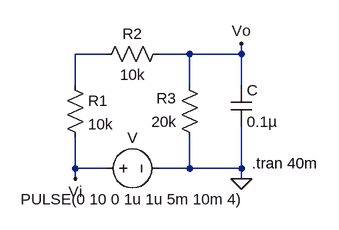
[diagram p0: schematic lab7-3.asc]
lab7-3.asc, the LTspice schematic file:
Version 4
SHEET 1 880 680
WIRE -48 64 -96 64
WIRE 80 64 32 64
WIRE 160 64 160 48
WIRE 160 64 80 64
WIRE -96 112 -96 64
WIRE 80 112 80 64
WIRE 160 112 160 64
WIRE -96 240 -96 192
WIRE -48 240 -96 240
WIRE 80 240 80 192
WIRE 80 240 32 240
WIRE 160 240 160 176
WIRE 160 240 80 240
WIRE -96 256 -96 240
WIRE 160 256 160 240
FLAG 160 256 0
FLAG -96 256 Vi
FLAG 160 48 Vo
SYMBOL voltage -64 240 R270
WINDOW 0 32 56 VTop 2
WINDOW 3 -32 56 VBottom 2
WINDOW 123 0 0 Left 2
WINDOW 39 0 0 Left 2
SYMATTR InstName V
SYMATTR Value PULSE(0 10 0 1u 1u 5m 10m 4)
SYMBOL res -112 96 R0
SYMATTR InstName R1
SYMATTR Value 10k
SYMBOL res 48 48 R90
WINDOW 0 0 56 VBottom 2
WINDOW 3 32 56 VTop 2
SYMATTR InstName R2
SYMATTR Value 10k
SYMBOL res 96 208 R180
WINDOW 0 36 76 Left 2
WINDOW 3 36 40 Left 2
SYMATTR InstName R3
SYMATTR Value 20k
SYMBOL cap 144 112 R0
SYMATTR InstName C
SYMATTR Value 0.1µ
TEXT 176 232 Left 2 !.tran 40m

The netlist it stands for:
* lab7-3.asc
V Vi 0 PULSE(0 10 0 1u 1u 5m 10m 4)
R1 N001 Vi 10k
R2 Vo N001 10k
R3 0 Vo 20k
C Vo 0 0.1µ
.tran 40m
.backanno
.end